# EAGLE design DyIO_Rev13_testjig (EAGLE 5.11)

## Sheet 1 of 6
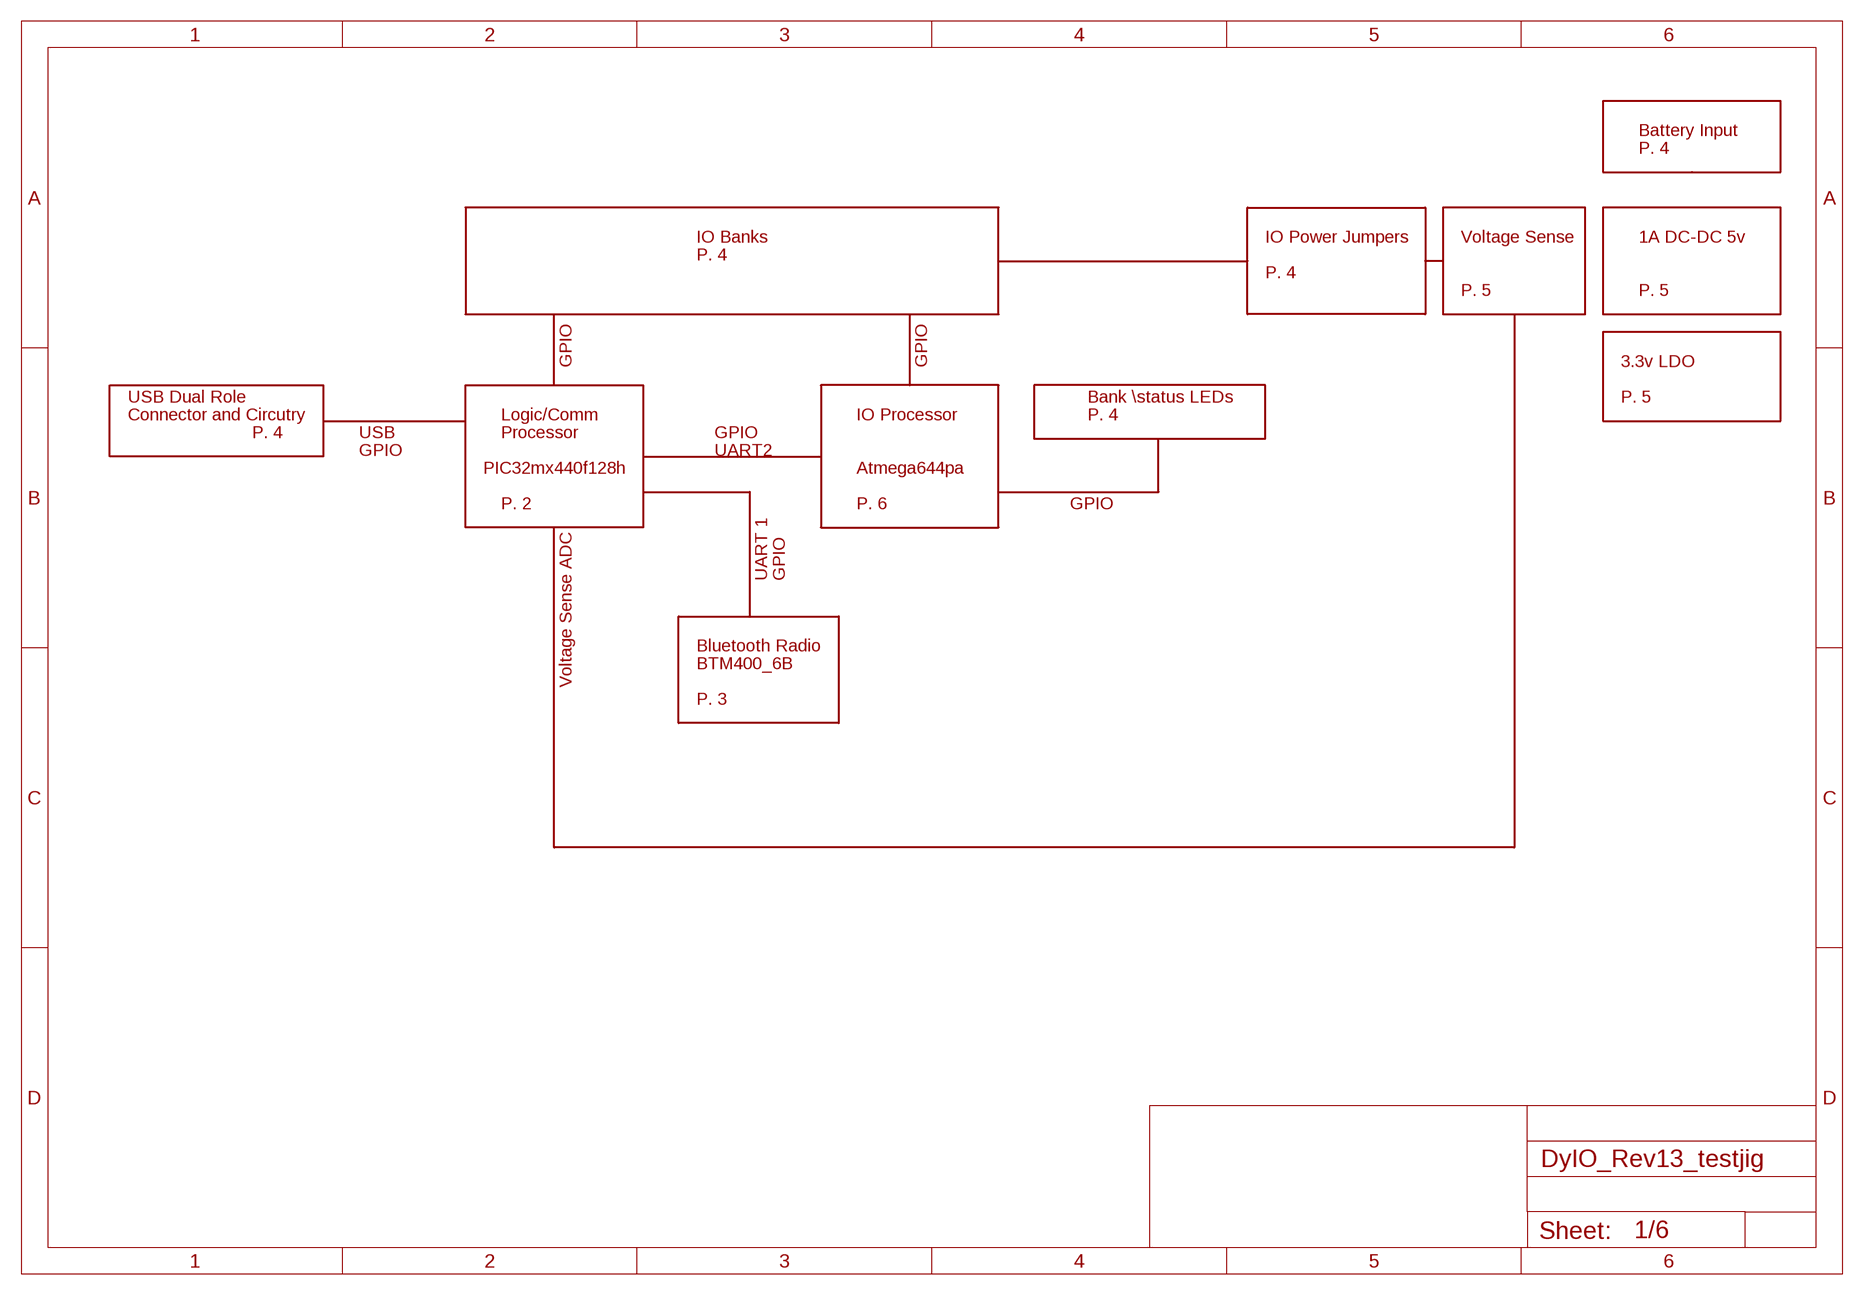
[diagram p0: schematic, sheet 1]

### Notes on the sheet
- Battery Input
- P. 4
- IO Banks | IO Power Jumpers | Voltage Sense | 1A DC-DC 5v
- P. 4
- P. 4
- P. 5 | P. 5
- GPIO | GPIO | 3.3v LDO
- USB Dual Role | Bank \status LEDs | P. 5
- Connector and Circutry | Logic/Comm | IO Processor | P. 4
- P. 4 | USB | Processor | GPIO
- GPIO | UART2
- PIC32mx440f128h | Atmega644pa
- P. 2 | P. 6 | GPIO
- UART 1 | GPIO
- Bluetooth Radio
- BTM400_6B
- Voltage Sense ADC
- P. 3

## Sheet 2 of 6
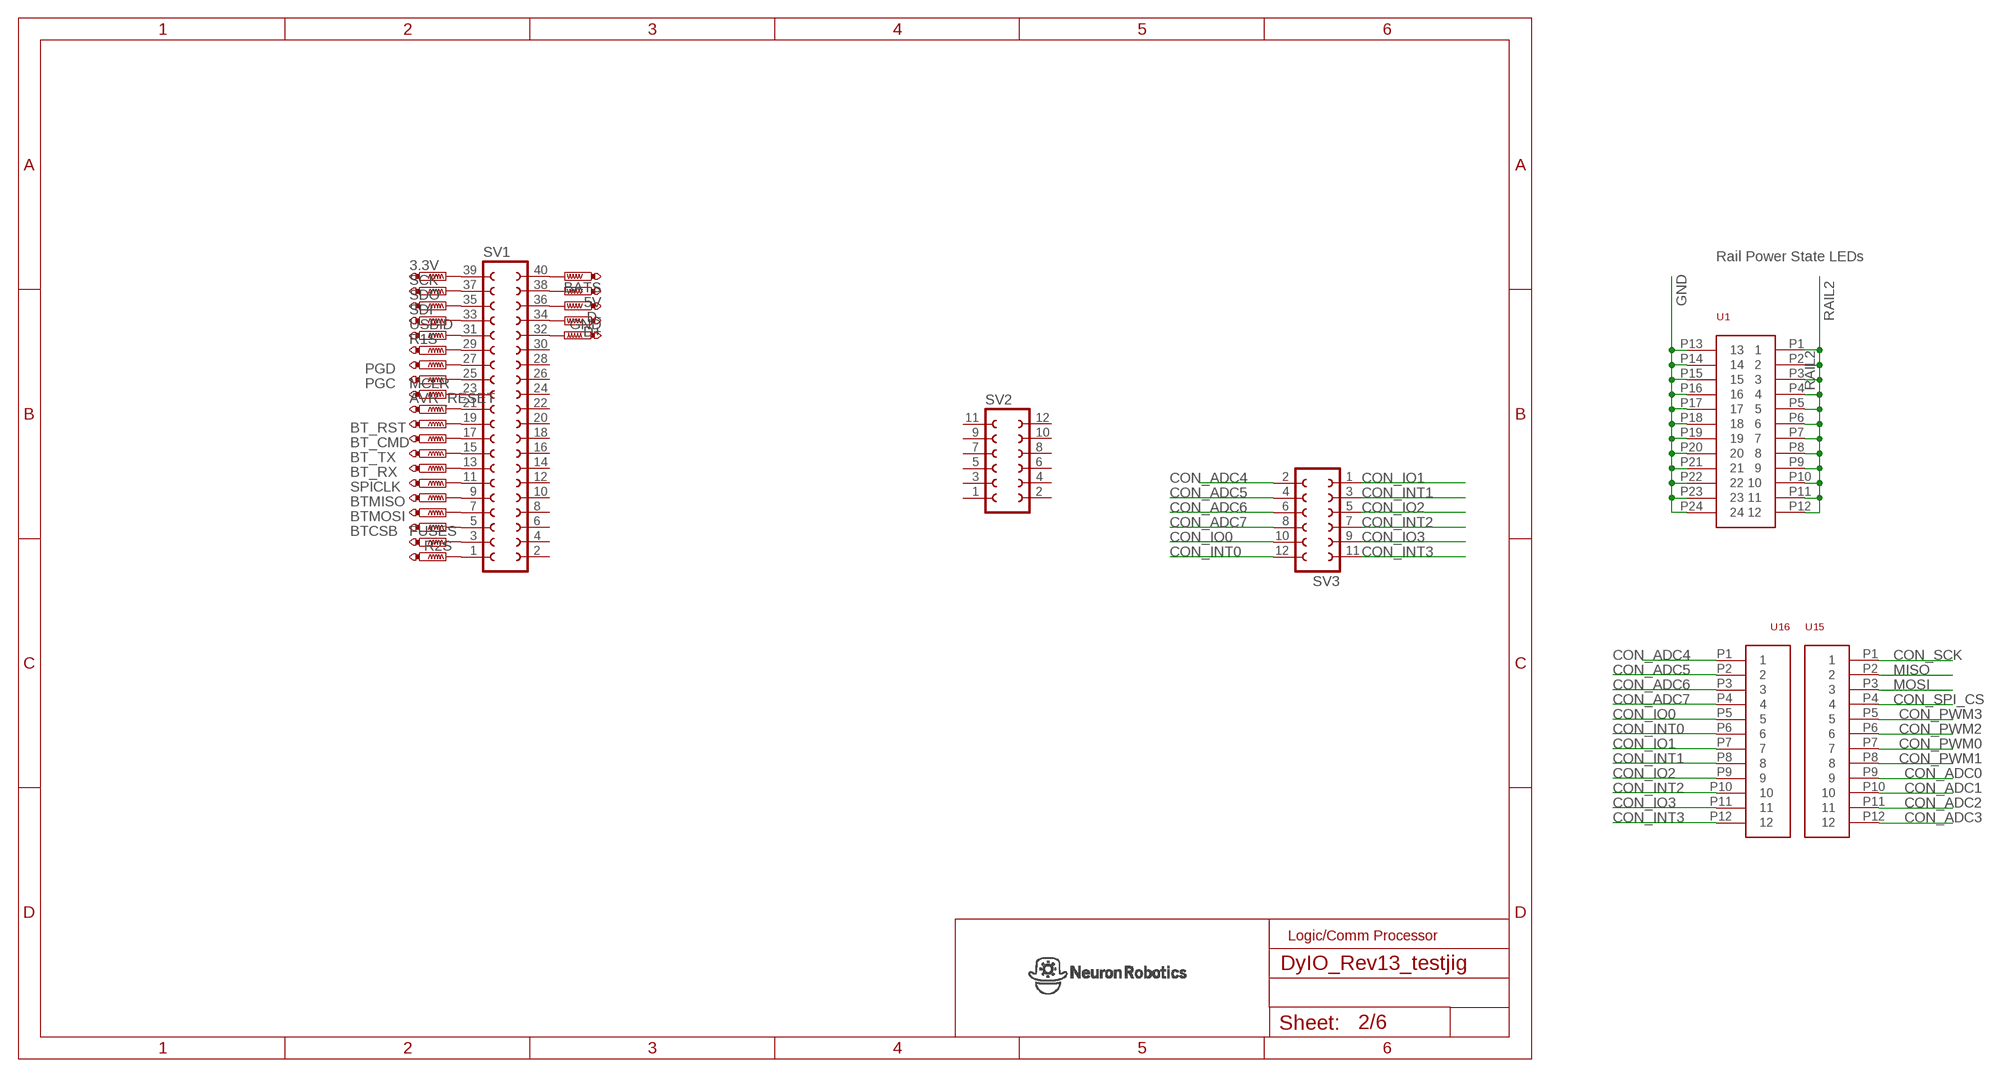
[diagram p1: schematic, sheet 2, part 1 of 2]
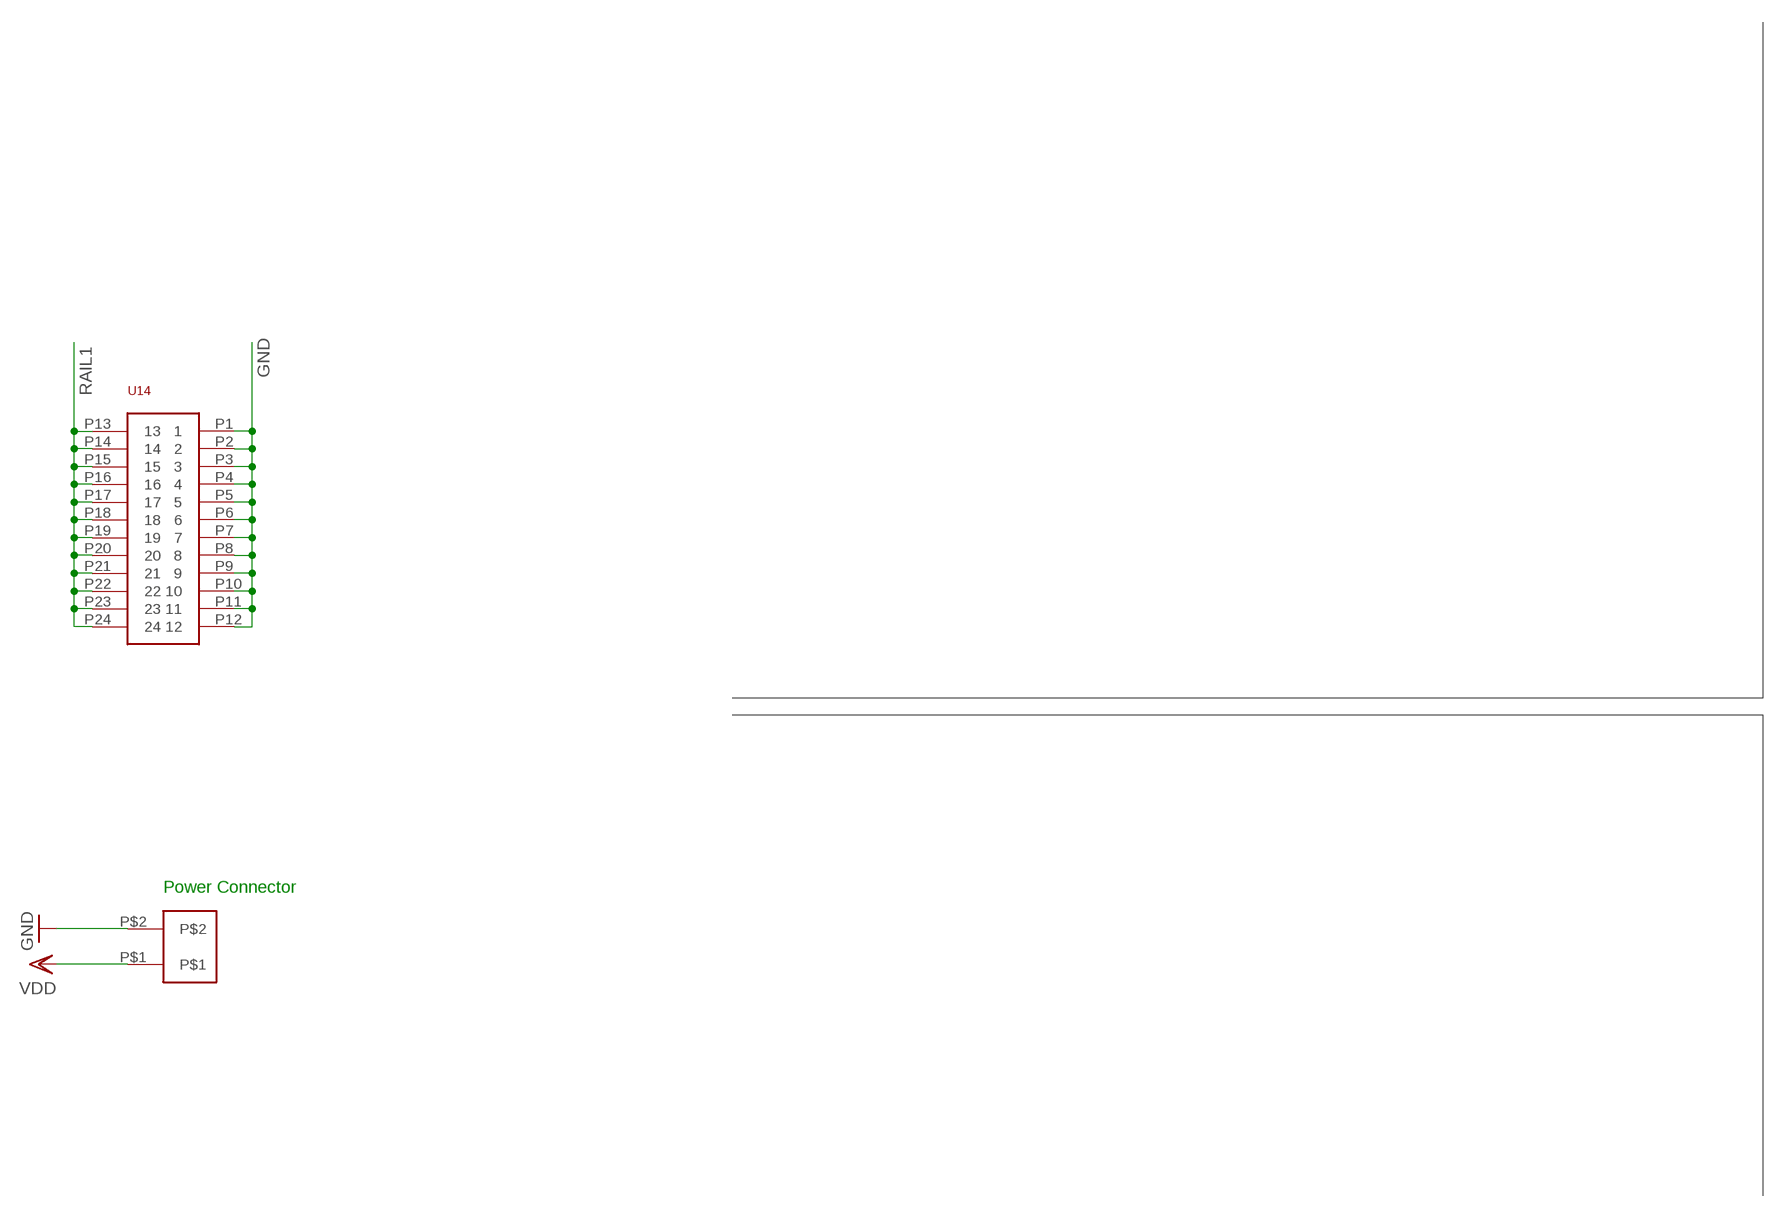
[diagram p2: schematic, sheet 2, part 2 of 2]

### Parts
3.3V  PTR1TP14R  [TP14R]
5V  PTR1TP14R  [TP14R]
AVR_RESET  PTR1TP14R  [TP14R]
BATS  PTR1TP14R  [TP14R]
BT_CMD  PTR1TP14R  [TP14R]
BT_RST  PTR1TP14R  [TP14R]
BT_RX  PTR1TP14R  [TP14R]
BT_TX  PTR1TP14R  [TP14R]
BTCSB  PTR1TP14R  [TP14R]
BTMISO  PTR1TP14R  [TP14R]
BTMOSI  PTR1TP14R  [TP14R]
D+  PTR1TP14R  [TP14R]
D-  PTR1TP14R  [TP14R]
FUSES  PTR1TP14R  [TP14R]
GND  PTR1B1,27  [B1,27]
MCLR  PTR1TP14R  [TP14R]
PGC  PTR1TP14R  [TP14R]
PGD  PTR1TP14R  [TP14R]
R1S  PTR1TP14R  [TP14R]
R2S  PTR1TP14R  [TP14R]
SCK  PTR1TP14R  [TP14R]
SDI  PTR1TP14R  [TP14R]
SDO  PTR1TP14R  [TP14R]
SPICLK  PTR1TP14R  [TP14R]
SV1  FE20-2  [FE20-2]
SV2  FE06-2  [FE06-2]
SV3  FE06-2  [FE06-2]
U1  2X12  [2X12]
U14  2X12  [2X12]
U15  1X12  [1X12]
U16  1X12  [1X12]
U$19  2P  [2PTH]
USBID  PTR1TP14R  [TP14R]

### Nets
CON_ADC0: U15.P9
CON_ADC1: U15.P10
CON_ADC2: U15.P11
CON_ADC3: U15.P12
CON_ADC4: SV3.2 U16.P1
CON_ADC5: SV3.4 U16.P2
CON_ADC6: SV3.6 U16.P3
CON_ADC7: SV3.8 U16.P4
CON_INT0: SV3.12 U16.P6
CON_INT1: SV3.3 U16.P8
CON_INT2: SV3.7 U16.P10
CON_INT3: SV3.11 U16.P12
CON_IO0: SV3.10 U16.P5
CON_IO1: SV3.1 U16.P7
CON_IO2: SV3.5 U16.P9
CON_IO3: SV3.9 U16.P11
CON_PWM0: U15.P7
CON_PWM1: U15.P8
CON_PWM2: U15.P6
CON_PWM3: U15.P5
CON_SCK: U15.P1
CON_SPI_CS: U15.P4
GND: U1.P13 U1.P14 U1.P15 U1.P16 U1.P17 U1.P18 U1.P19 U1.P20 U1.P21 U1.P22 U1.P23 U1.P24 U14.P1 U14.P2 U14.P3 U14.P4 U14.P5 U14.P6 U14.P7 U14.P8 U14.P9 U14.P10 U14.P11 U14.P12 U$19.P$2
MISO: U15.P2
MOSI: U15.P3
N$30: R2S.TP SV1.1
N$31: FUSES.TP SV1.3
N$32: BTCSB.TP SV1.5
N$33: BTMOSI.TP SV1.7
N$34: BTMISO.TP SV1.9
N$35: SPICLK.TP SV1.11
N$36: BT_RX.TP SV1.13
N$37: BT_TX.TP SV1.15
N$38: BT_CMD.TP SV1.17
N$39: BT_RST.TP SV1.19
N$40: MCLR.TP SV1.23
N$41: AVR_RESET.TP SV1.21
N$42: PGC.TP SV1.25
N$43: PGD.TP SV1.27
N$44: R1S.TP SV1.29
N$45: SV1.31 USBID.TP
N$46: SDI.TP SV1.33
N$47: SDO.TP SV1.35
N$48: SCK.TP SV1.37
N$49: 3.3V.TP SV1.39
N$50: BATS.TP SV1.40
N$51: 5V.TP SV1.38
N$52: D-.TP SV1.36
N$53: D+.TP SV1.34
N$54: GND.PP(TP) SV1.32
RAIL1: U14.P13 U14.P14 U14.P15 U14.P16 U14.P17 U14.P18 U14.P19 U14.P20 U14.P21 U14.P22 U14.P23 U14.P24
RAIL2: U1.P1 U1.P2 U1.P3 U1.P4 U1.P5 U1.P6 U1.P7 U1.P8 U1.P9 U1.P10 U1.P11 U1.P12
VDD: U$19.P$1
Unconnected: SV1.2 SV1.4 SV1.6 SV1.8 SV1.10 SV1.12 SV1.14 SV1.16 SV1.18 SV1.20 SV1.22 SV1.24 SV1.26 SV1.28 SV1.30 SV2.1 SV2.2 SV2.3 SV2.4 SV2.5 SV2.6 SV2.7 SV2.8 SV2.9 SV2.10 SV2.11 SV2.12

### Notes on the sheet
- Rail Power State LEDs
- Power Connector
- Logic/Comm Processor

## Sheet 3 of 6
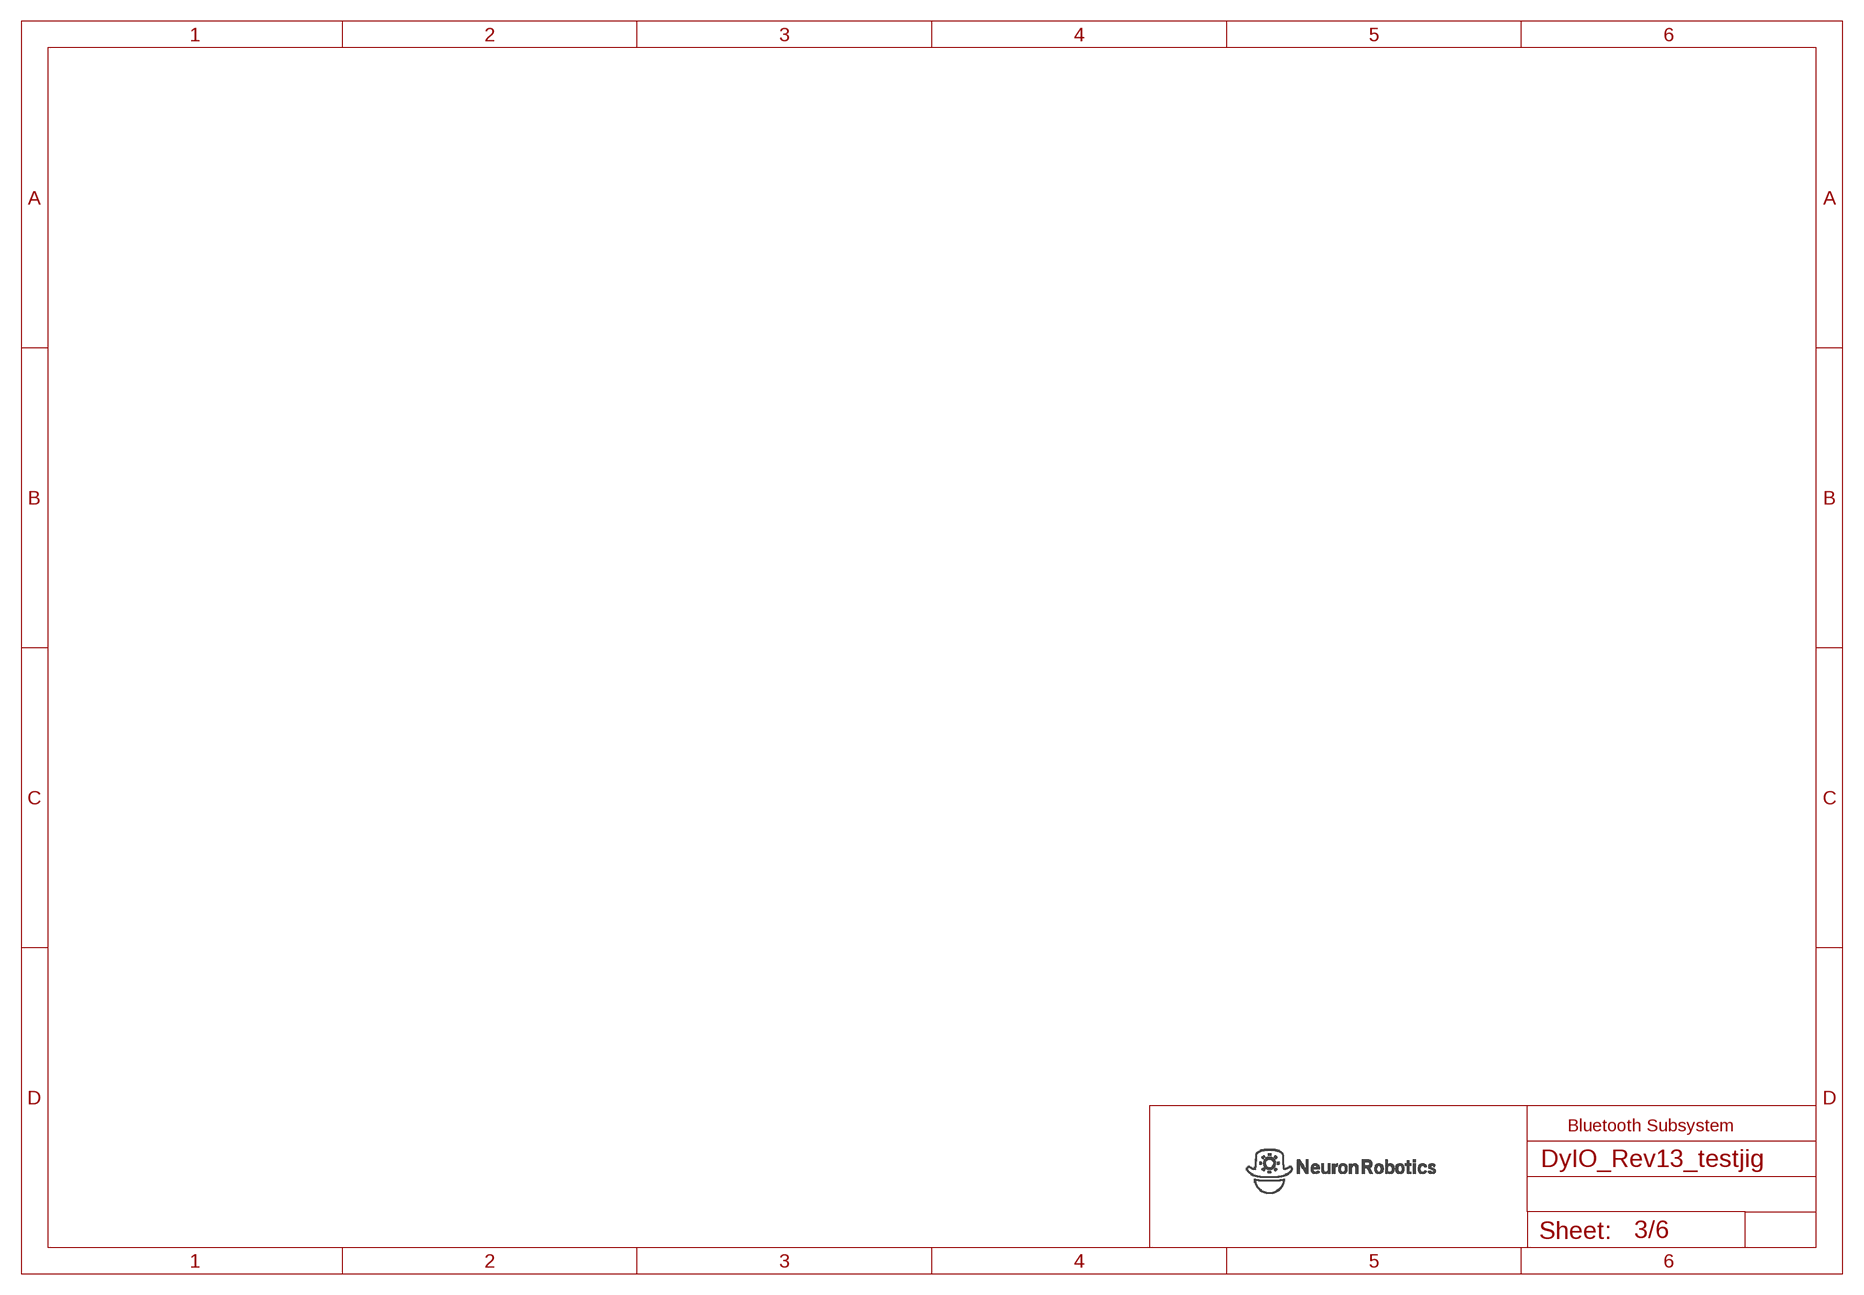
[diagram p3: schematic, sheet 3]

### Notes on the sheet
- Bluetooth Subsystem

## Sheet 4 of 6
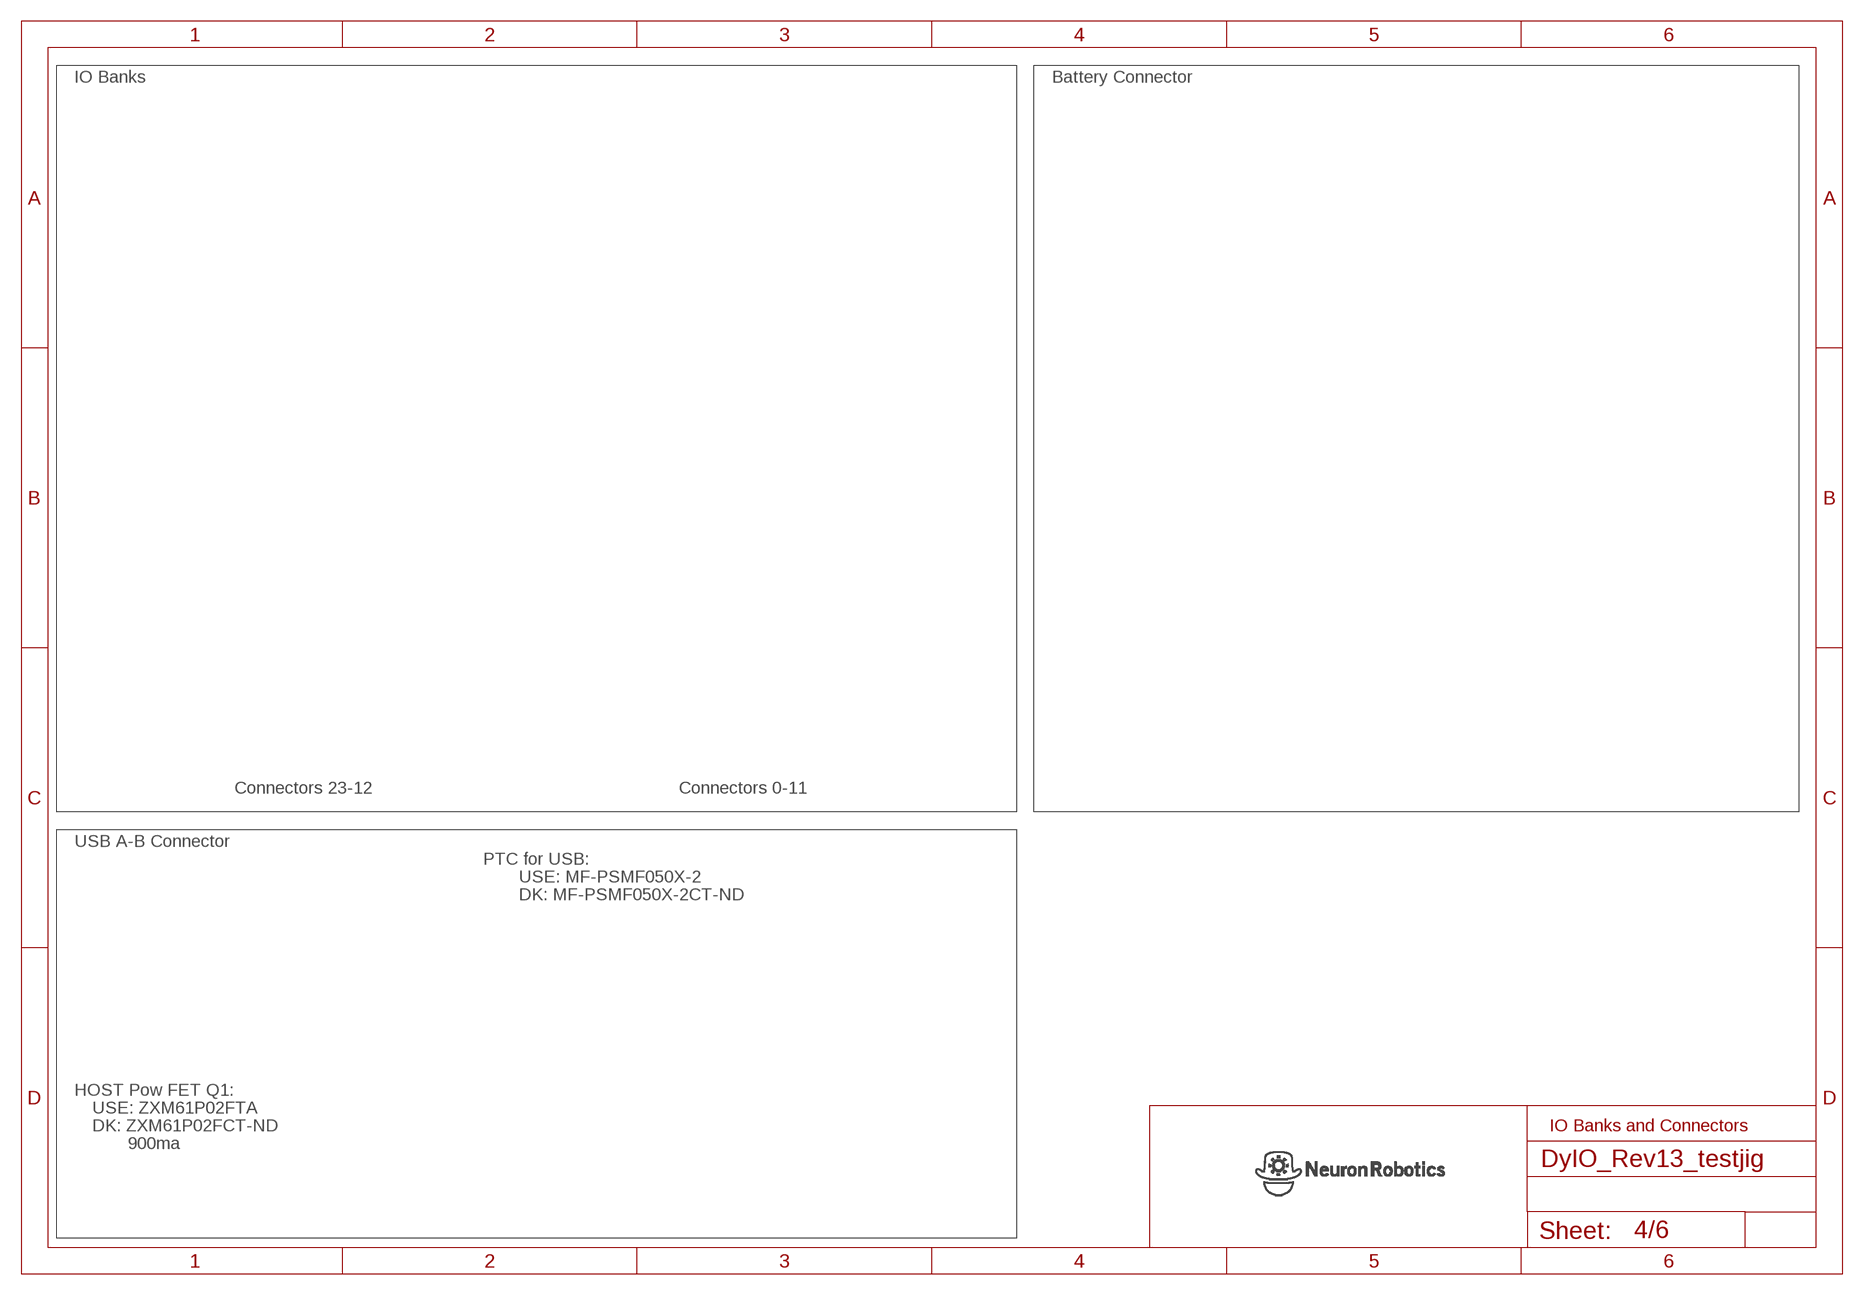
[diagram p4: schematic, sheet 4]

### Notes on the sheet
- IO Banks | Battery Connector
- Connectors 23-12 | Connectors 0-11
- USB A-B Connector
- PTC for USB:
- USE: MF-PSMF050X-2
- DK: MF-PSMF050X-2CT-ND
- HOST Pow FET Q1:
- USE: ZXM61P02FTA
- DK: ZXM61P02FCT-ND | IO Banks and Connectors
- 900ma

## Sheet 5 of 6
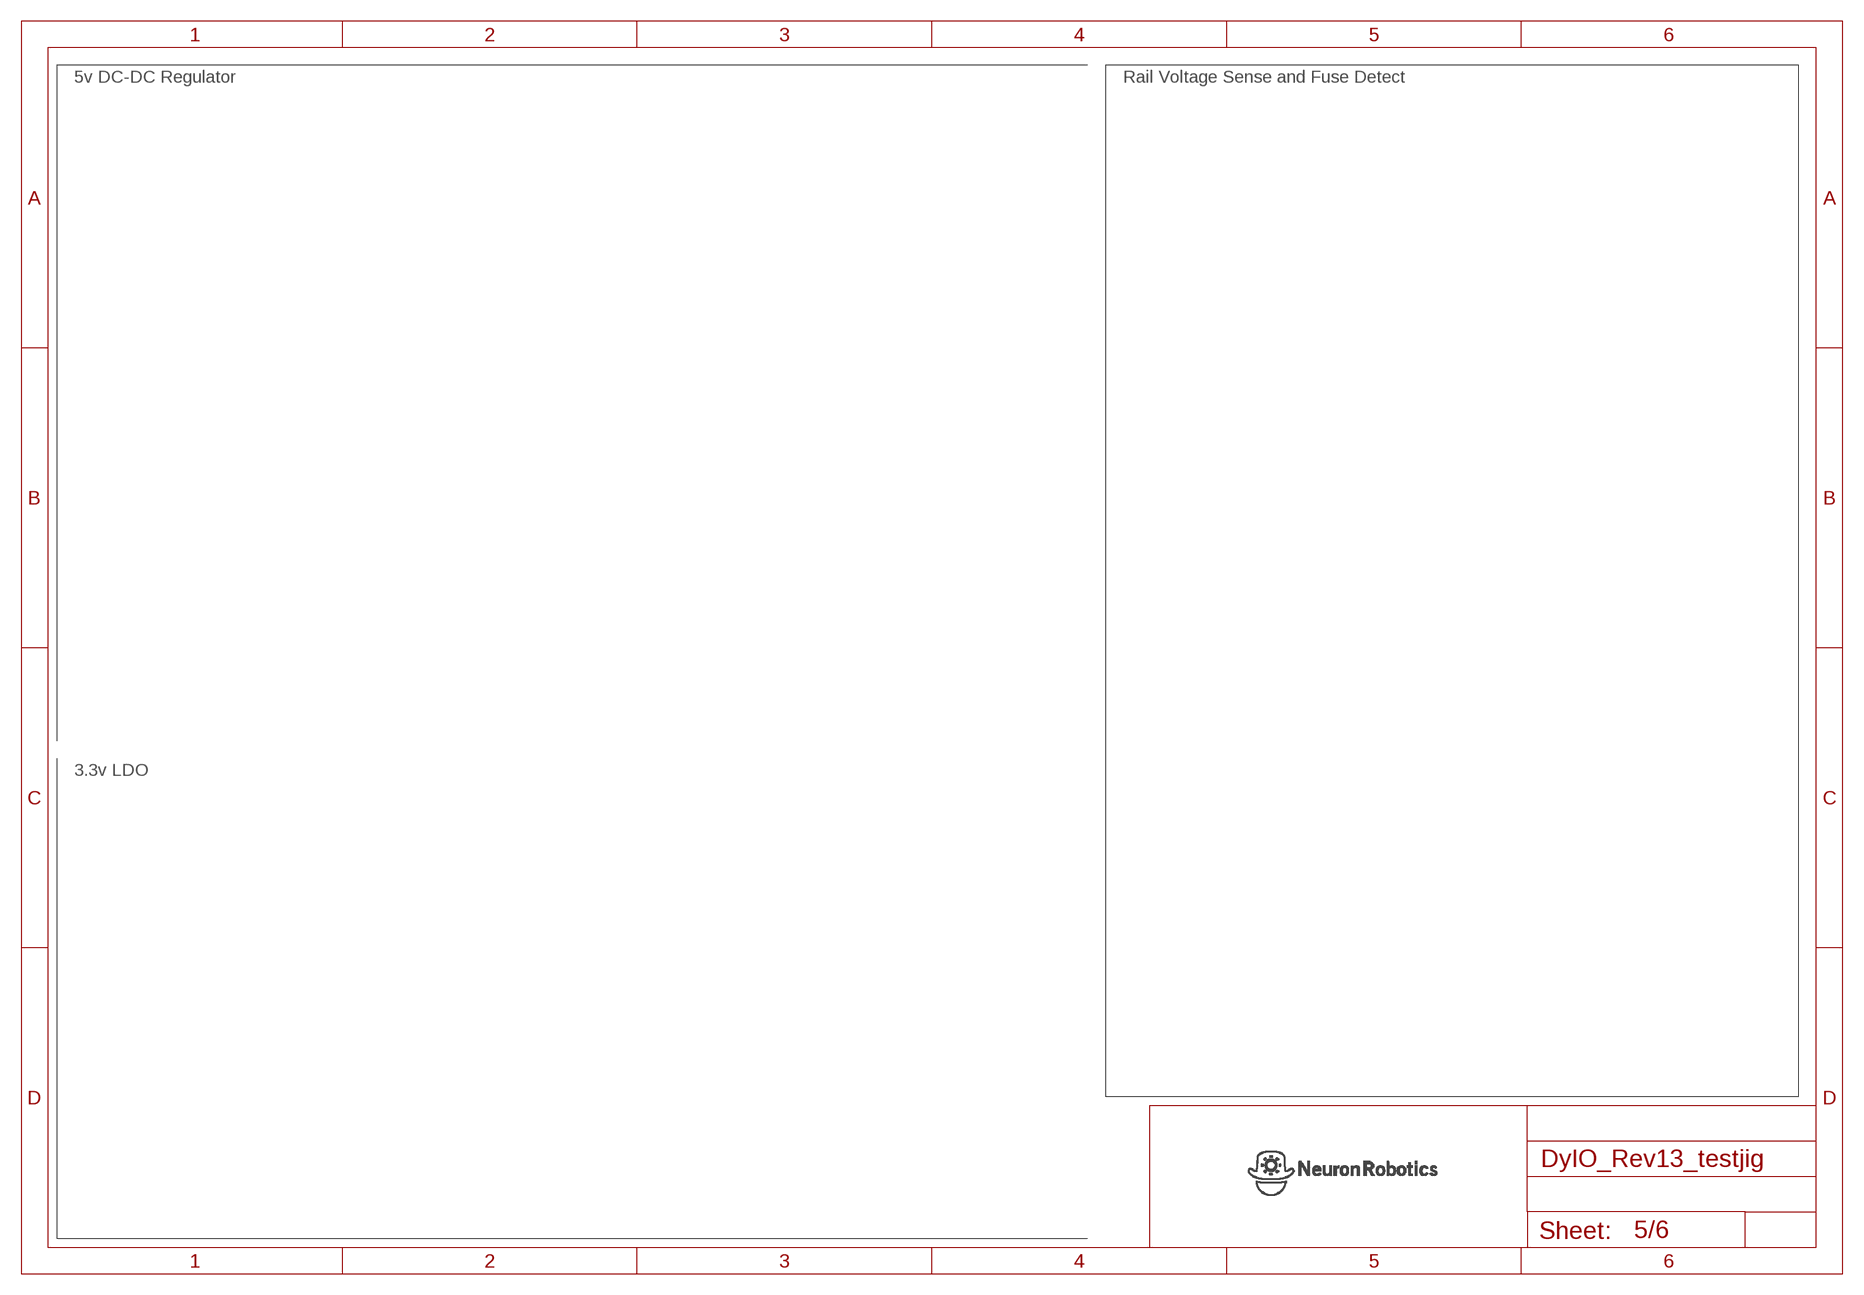
[diagram p5: schematic, sheet 5]

### Notes on the sheet
- 5v DC-DC Regulator | Rail Voltage Sense and Fuse Detect
- 3.3v LDO

## Sheet 6 of 6
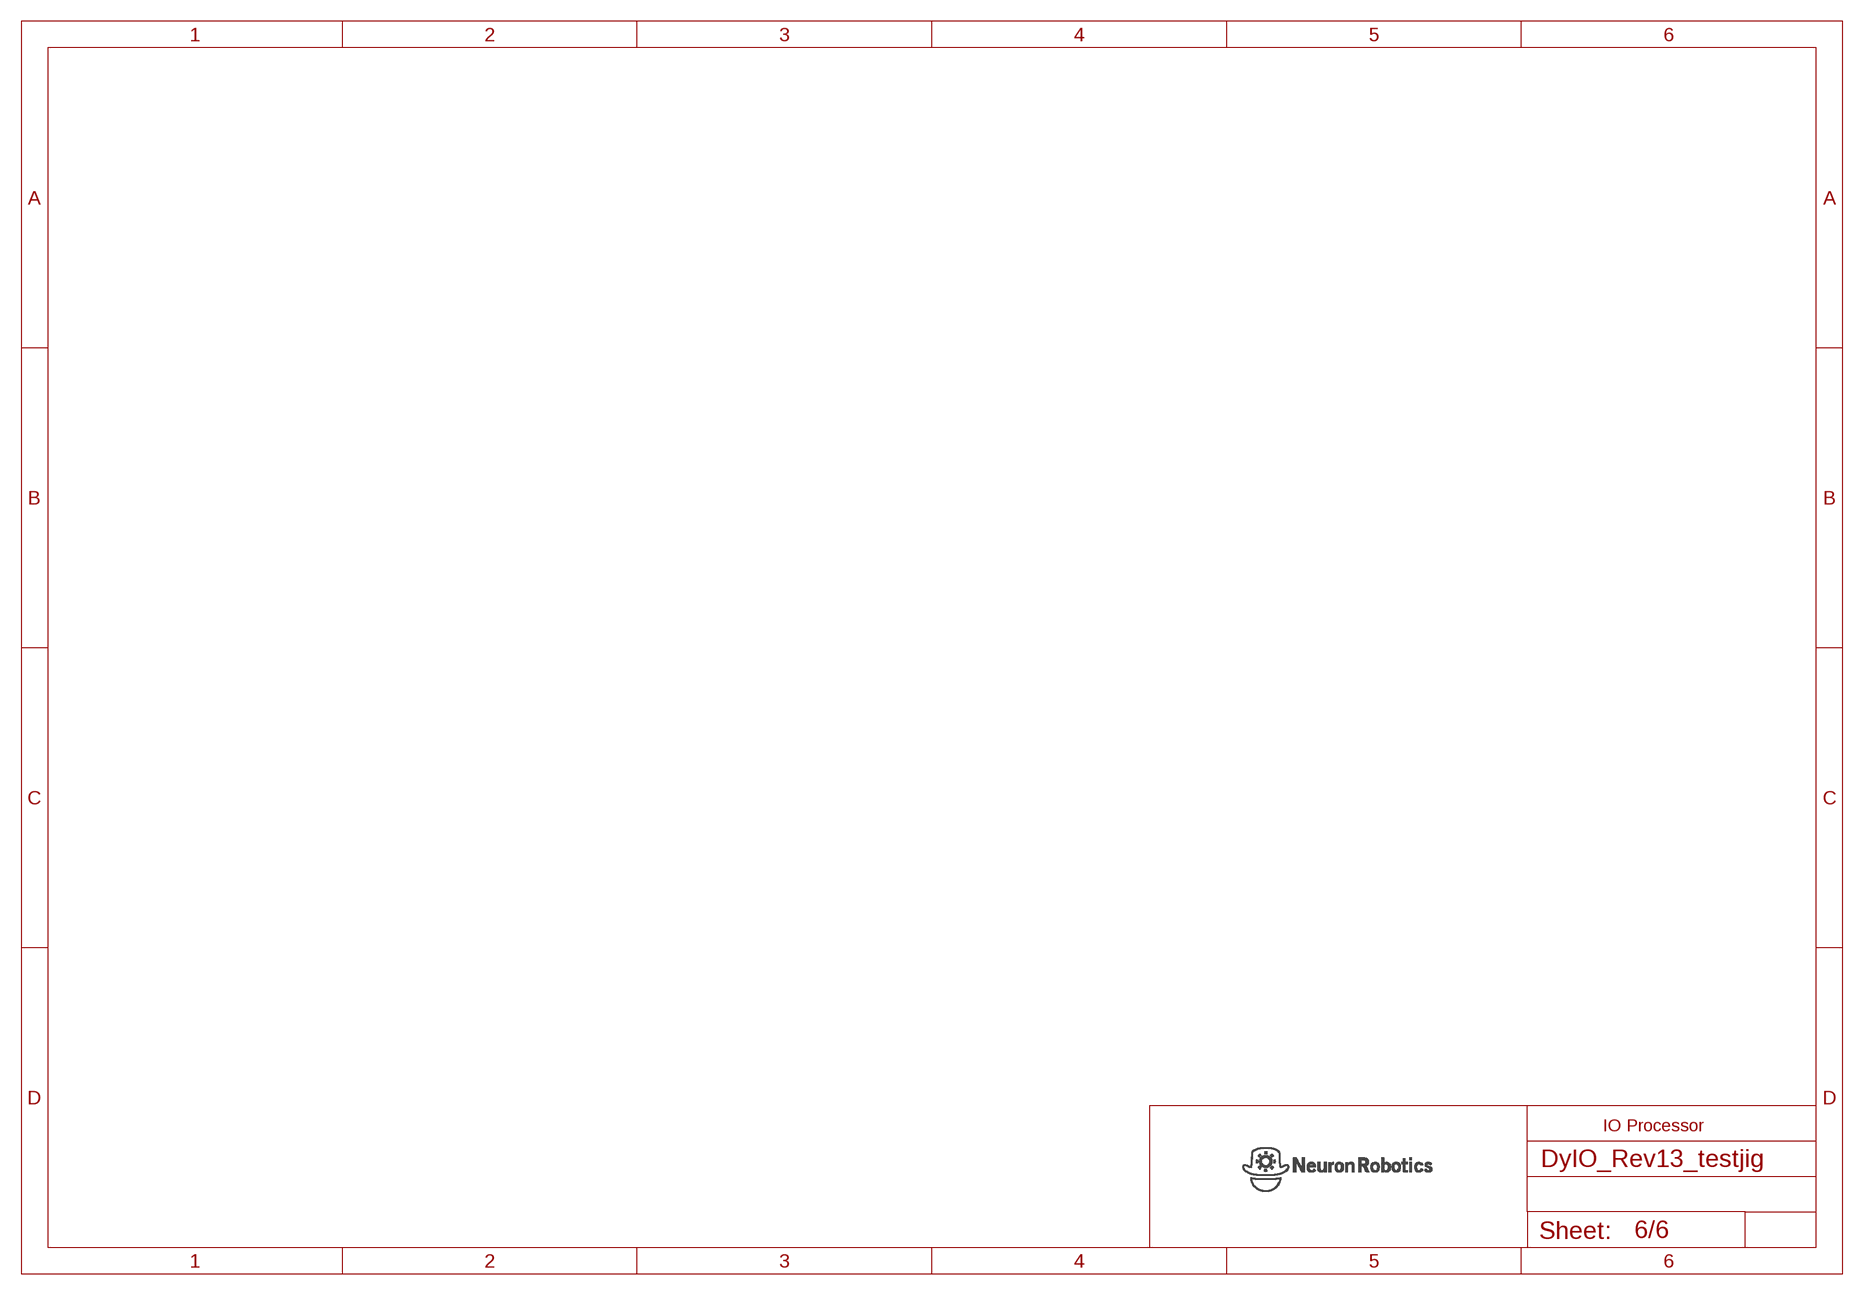
[diagram p6: schematic, sheet 6]

### Notes on the sheet
- IO Processor

## Library data of the parts
3.3V 5V AVR_RESET BATS BT_CMD BT_RST BT_RX BT_TX BTCSB BTMISO BTMOSI D+ D- FUSES GND MCLR PGC PGD R1S R2S SCK SDI SDO SPICLK USBID = testpad:PTR1: TEST PIN
SV1 = con-lsta:FE20-2: FEMALE HEADER; OC_FARNELL: unknown; OC_NEWARK: unknown
SV2 SV3 = con-lsta:FE06-2: FEMALE HEADER; OC_FARNELL: unknown; OC_NEWARK: unknown
U1 U14 = 1x12_header:2X12
U15 U16 = 1x12_header:1X12
U$19 = con_2h_70555-0001:2P

## Board
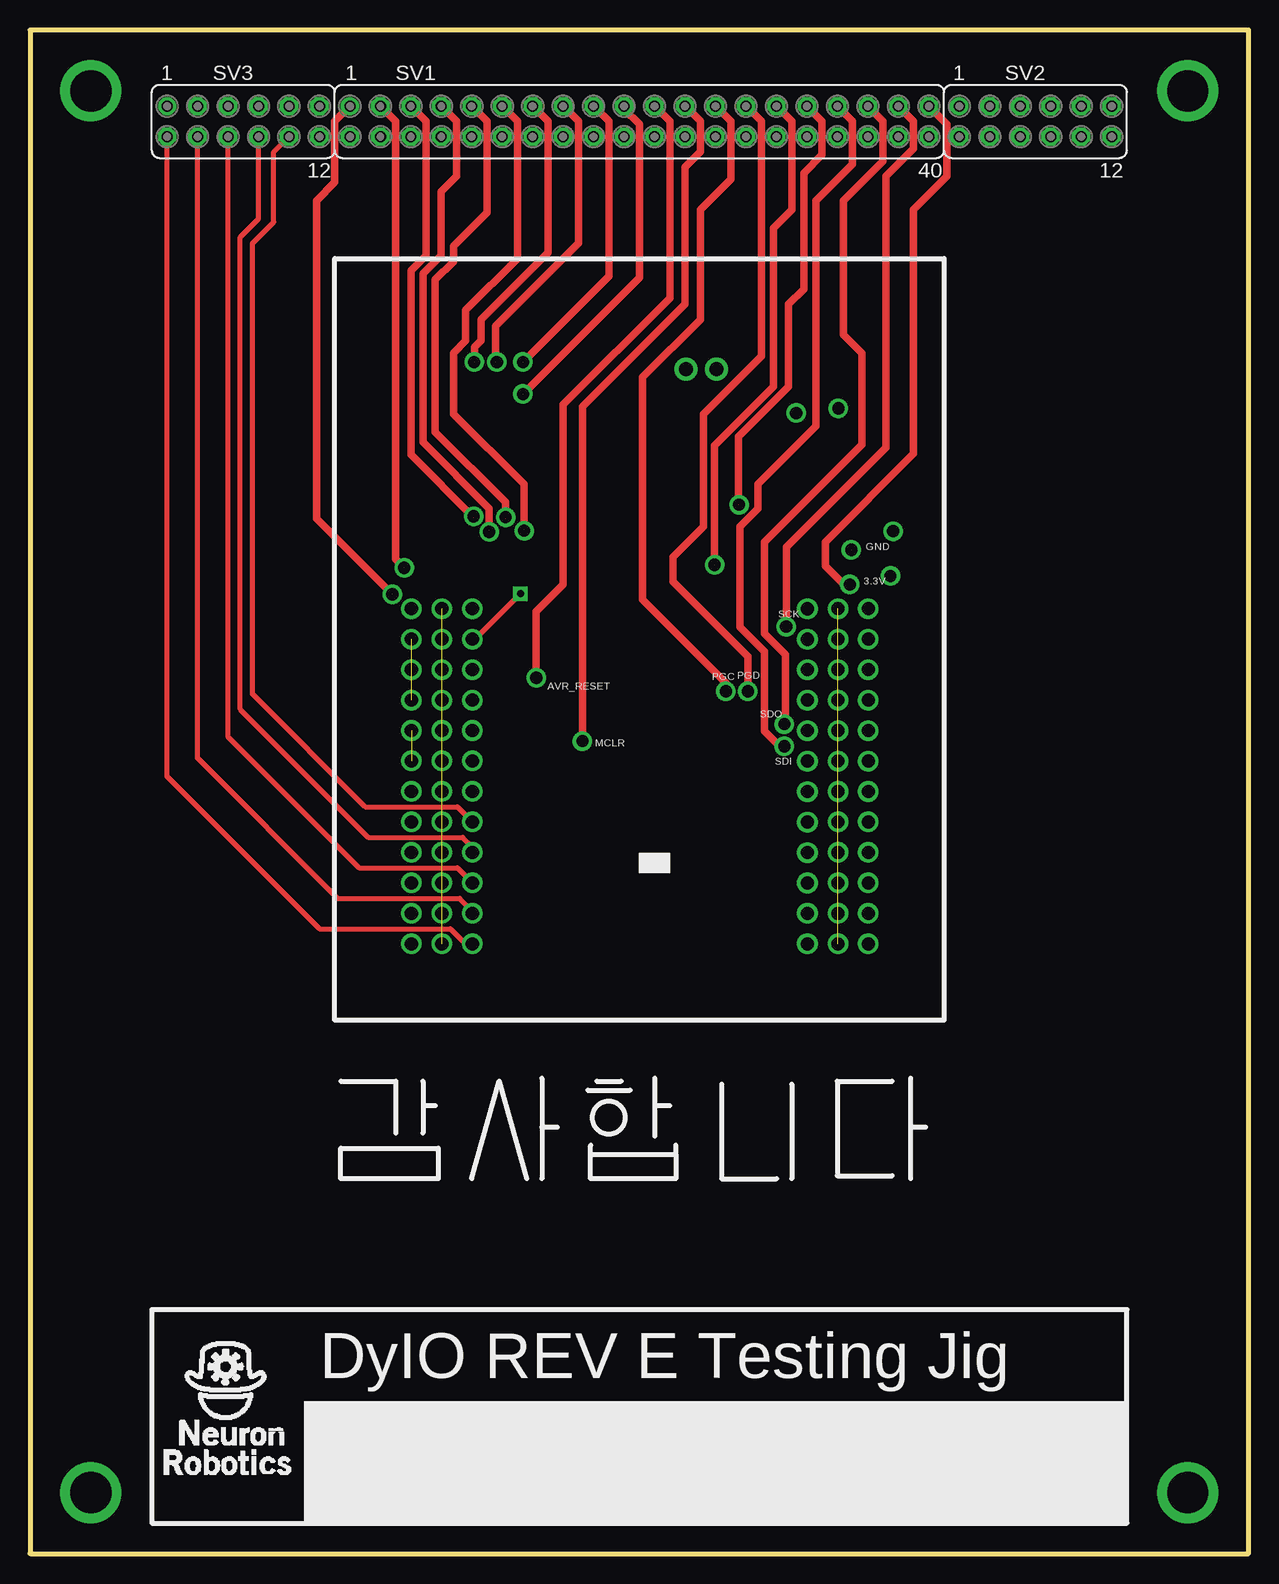
[diagram p7: board, top side]
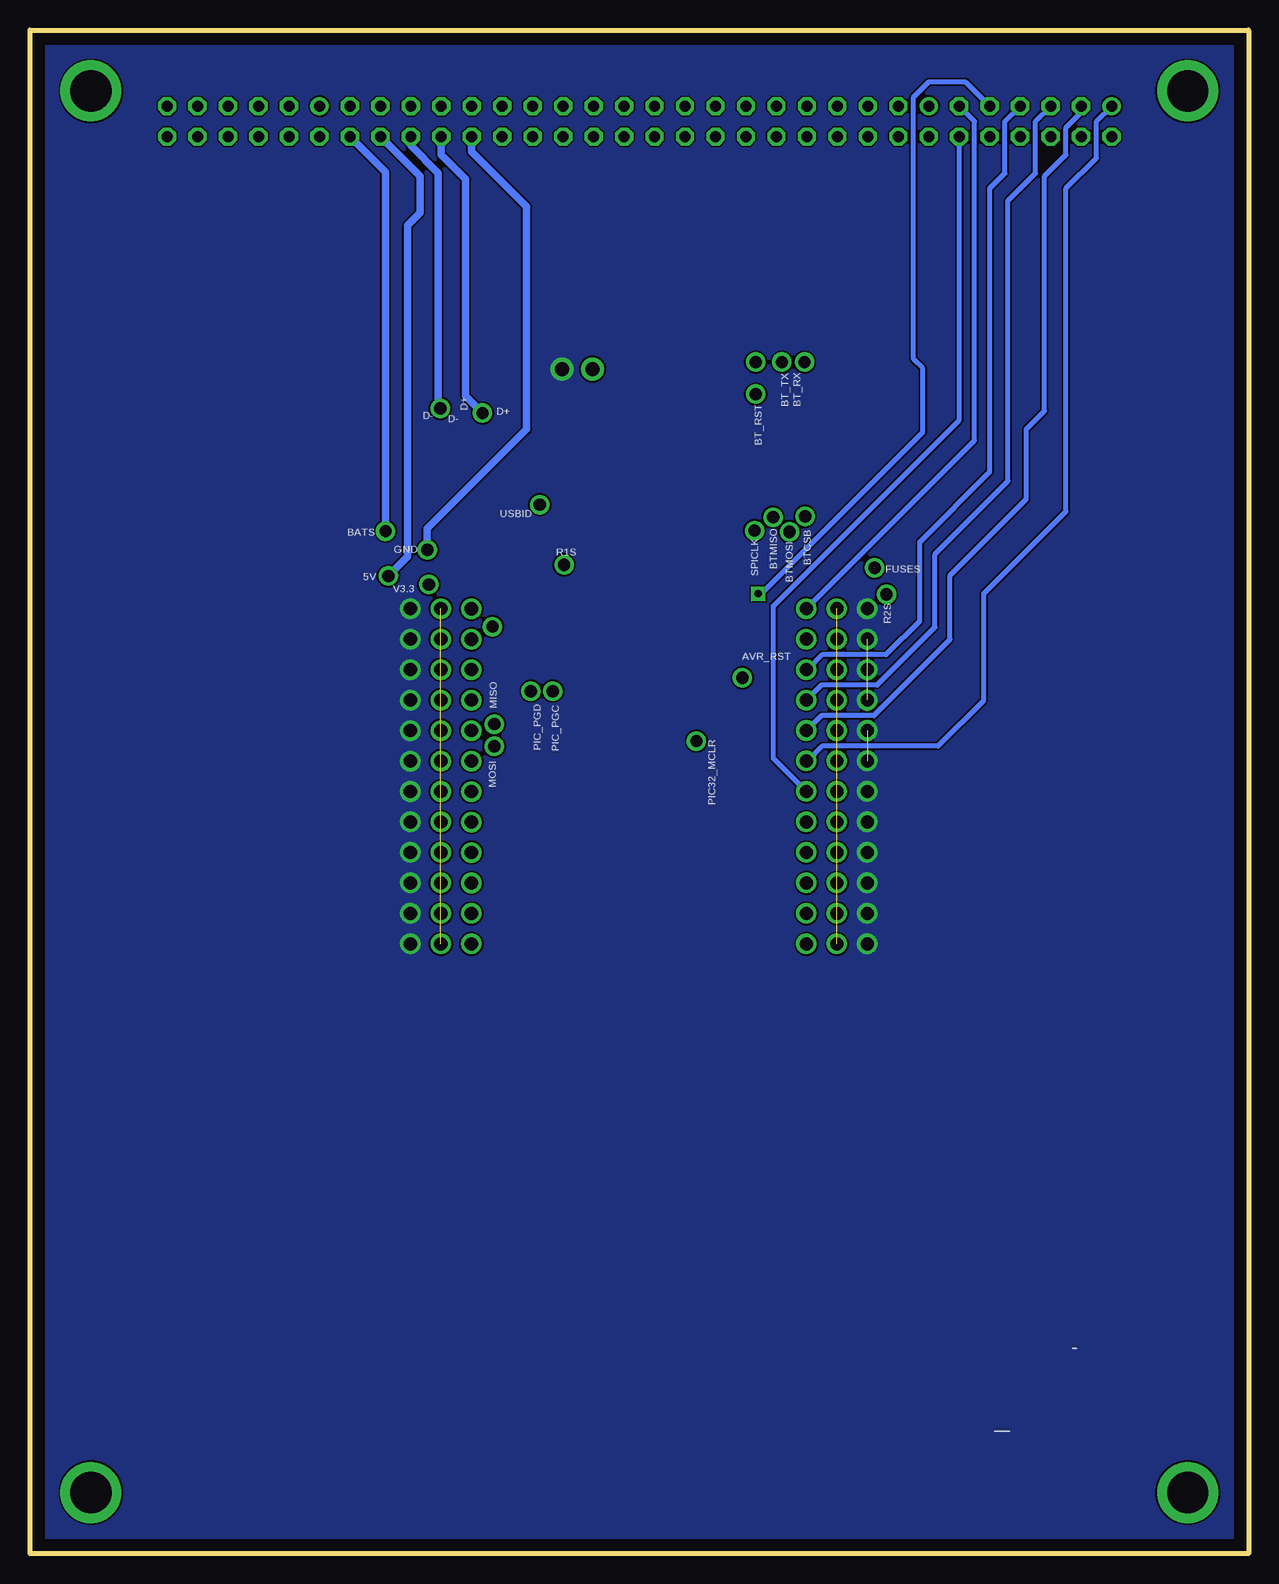
[diagram p8: board, bottom side, seen from below]

Size 101.6 x 127 mm. Coordinates in mm from the lower left corner, seen from the top.
Outline: 0,0 101.6,0 101.6,127 0,127 0,0
Copper layers (1*16): Top 0.035mm / dielectric 1.5mm / Bottom 0.035mm
Design rules "default *": minimum track width 6mil, minimum drill 15mil, track to track 6mil, track to pad 6mil, pad to pad 6mil, via to via 6mil, smd to smd 6mil, copper to edge 40mil, drill to drill 6mil, minimum pad ring 12mil, minimum via ring 12mil, stop-mask expansion 4mil, vias tented up to drill 20mil, thermal gap 0mil

### Footprints (pad centres in the part's own frame; a part is rotated, then mirrored left to right if it is on the bottom)
TP14R = smd 1.4 x 1.4: TP 0,0
B1,27 = smd 1.27 x 1.27: PP 0,0
FE20-2 = drill 0.914 round: 1 -24.13,1.27 | drill 0.914 octagon: 2 -24.13,-1.27; 3 -21.59,1.27; 4 -21.59,-1.27; 5 -19.05,1.27; 6 -19.05,-1.27; 7 -16.51,1.27; 8 -16.51,-1.27; 9 -13.97,1.27; 10 -13.97,-1.27; 11 -11.43,1.27; 12 -11.43,-1.27; 13 -8.89,1.27; 14 -8.89,-1.27; 15 -6.35,1.27; 16 -6.35,-1.27; 17 -3.81,1.27; 18 -3.81,-1.27; 19 -1.27,1.27; 20 -1.27,-1.27; 21 1.27,1.27; 22 1.27,-1.27; 23 3.81,1.27; 24 3.81,-1.27; 25 6.35,1.27; 26 6.35,-1.27; 27 8.89,1.27; 28 8.89,-1.27; 29 11.43,1.27; 30 11.43,-1.27; 31 13.97,1.27; 32 13.97,-1.27; 33 16.51,1.27; 34 16.51,-1.27; 35 19.05,1.27; 36 19.05,-1.27; 37 21.59,1.27; 38 21.59,-1.27; 39 24.13,1.27; 40 24.13,-1.27
FE06-2 = drill 0.914 round: 1 -6.35,1.27 | drill 0.914 octagon: 2 -6.35,-1.27; 3 -3.81,1.27; 4 -3.81,-1.27; 5 -1.27,1.27; 6 -1.27,-1.27; 7 1.27,1.27; 8 1.27,-1.27; 9 3.81,1.27; 10 3.81,-1.27; 11 6.35,1.27; 12 6.35,-1.27
2X12 = drill 1.1 round: P1 -0.635,0.635; P2 1.905,0.635; P3 4.445,0.635; P4 6.985,0.635; P5 9.525,0.635; P6 12.065,0.635; P7 14.605,0.635; P8 17.145,0.635; P9 19.685,0.635; P10 22.225,0.635; P11 24.765,0.635; P12 27.305,0.635; P13 -0.635,-1.905; P14 1.905,-1.905; P15 4.445,-1.905; P16 6.985,-1.905; P17 9.525,-1.905; P18 12.065,-1.905; P19 14.605,-1.905; P20 17.145,-1.905; P21 19.685,-1.905; P22 22.225,-1.905; P23 24.765,-1.905; P24 27.305,-1.905
1X12 = drill 1.1 round: P1 -10.795,3.175; P2 -8.255,3.175; P3 -5.715,3.175; P4 -3.175,3.175; P5 -0.635,3.175; P6 1.905,3.175; P7 4.445,3.175; P8 6.985,3.175; P9 9.525,3.175; P10 12.065,3.175; P11 14.605,3.175; P12 17.145,3.175
2PTH = drill 1.168 pad 1.93 round: P$1 -2.54,0; P$2 0,0

### Placement (x,y rotation side)
3.3V  68.35,80.75 0 top
5V  71.73,81.48 90 bottom
AVR_RESET  42.2,73 0 top
BATS  71.96,85.22 0 bottom
BT_CMD  41.1,99.31 0 bottom
BT_RST  41.1,96.65 0 bottom
BT_RX  37.06,99.31 0 bottom
BT_TX  38.81,99.31 0 bottom
BTCSB  36.98,86.36 0 bottom
BTMISO  39.65,86.28 0 bottom
BTMOSI  38.28,85.29 0 bottom
D+  63.88,95.07 90 bottom
D-  67.37,95.45 0 bottom
FUSES  31.19,82.17 0 bottom
GND  68.49,83.66 0 top
MCLR  46.06,67.7 0 top
PGC  58,71.85 90 top
PGD  59.85,71.85 90 top
R1S  57.06,82.41 0 bottom
R2S  30.2,79.96 0 bottom
SCK  63.05,77.25 0 top
SDI  62.9,67.3 0 top
SDO  62.9,69.15 0 top
SPICLK  41.17,85.37 0 bottom
SV1  50.8,119.38 0 top
SV2  83.82,119.38 0 top
SV3  17.78,119.38 0 top
U1  33.7,78.13 270 top
U14  69.26,78.13 270 top
U15  67.99,67.96 270 bottom
U16  40.06,61.62 90 top
U$19  57.23,98.73 0 top
USBID  59.08,87.43 0 bottom

### Tracks (layer width: path | path; a pad name or v marks a point on that pad's centre or on a via)
CON_ADC4
  Top 0.406: SV3.2 11.43,64.77 24.13,52.07 35.05,52.07 36.3,50.82 U16.P1
CON_ADC5
  Top 0.406: SV3.4 13.97,66.29 25.65,54.61 35.81,54.61 36.88,53.54 U16.P2
CON_ADC6
  Top 0.406: SV3.6 16.51,68.07 27.43,57.15 35.64,57.15 U16.P3
CON_ADC7
  Top 0.406: SV3.8 19.05,111.25 17.53,109.73 17.53,70.36 28.19,59.69 36.07,59.69 36.88,58.88 U16.P4
CON_INT0
  Bottom 0.406: U16.P6 39.62,66.27 39.62,78.99 24.13,94.49 SV3.12
CON_INT1
  Bottom 0.406: U16.P8 35.64,69.85 31.24,69.85 24.89,76.2 24.89,81.53 18.54,87.88 18.54,93.73 17.02,95.25 17.02,114.81 15.24,116.59 15.24,118.87 13.97,120.14 SV3.3
CON_INT2
  Bottom 0.406: U16.P10 36.81,73.68 35.56,74.93 30.23,74.93 27.43,77.72 27.43,84.33 21.59,90.17 21.59,113.79 20.32,115.06 20.32,119.38 SV3.7
CON_INT3
  Bottom 0.406: U16.P12 22.86,92.78 22.86,119.38 SV3.11
CON_IO0
  Top 0.406: SV3.10 20.32,116.84 20.32,111 18.54,109.22 18.54,71.63 27.94,62.23 35.64,62.23 U16.P5
CON_IO1
  Bottom 0.406: U16.P7 36.81,66.06 35.56,67.31 25.91,67.31 22.1,71.12 22.1,80.01 15.24,86.87 15.24,113.79 12.7,116.33 12.7,119.38 SV3.1
CON_IO2
  Bottom 0.406: U16.P9 35.64,72.39 30.99,72.39 26.16,77.22 26.16,83.31 20.07,89.41 20.07,112.78 17.78,115.06 17.78,119.38 SV3.5
CON_IO3  (via drill 0.6)
  Top 0.406: U16.P11 37.11,76.22 v40.89,80.01
  Bottom 0.406: v40.89,80.01 40.64,80.01 27.18,93.47 27.18,98.81 27.94,99.57 27.94,121.41 26.67,122.68 23.62,122.68 SV3.9
GND  (3 unrouted)
  pour Bottom: 0,127 101.6,127 101.6,25.4 101.6,0 0,0
N$1  (via drill 1.02)
  other vias: 41.2,85.27
N$2  (via drill 1.02)
  other vias: 39.65,86.39
N$3  (via drill 1.02)
  other vias: 38.28,85.17
N$4  (via drill 1.02)
  other vias: 36.98,86.46
N$5  (via drill 1.02)
  other vias: 37.03,99.31
N$6  (via drill 1.02)
  other vias: 38.91,99.31
N$7  (via drill 1.02)
  other vias: 41.1,99.31
N$8  (via drill 1.02)
  other vias: 41.1,96.65
N$9  (via drill 1.02)
  other vias: 67.39,95.45
N$10  (via drill 1.02)
  other vias: 63.88,95.07
N$11  (via drill 1.02)
  other vias: 71.96,85.22
N$12  (via drill 1.02)
  other vias: 71.73,81.48
N$13  (via drill 1.02)
  other vias: 68.48,83.67
N$14  (via drill 1.02)
  other vias: 68.35,80.77
N$15  (via drill 1.02)
  other vias: 63.04,77.27
N$16  (via drill 1.02)
  other vias: 59.84,71.88
N$17  (via drill 1.02)
  other vias: 58.01,71.88
N$18  (via drill 1.02)
  other vias: 62.89,69.14
N$19  (via drill 1.02)
  other vias: 62.89,67.28
N$20  (via drill 1.02)
  other vias: 46.05,67.72
N$21  (via drill 1.02)
  other vias: 42.21,73
N$22  (via drill 1.02)
  other vias: 31.19,82.17
N$23  (via drill 1.02)
  other vias: 30.2,79.96
N$24  (via drill 1.02)
  other vias: 59.11,87.43
N$25  (via drill 1.02)
  other vias: 57.07,82.42
N$26  (via drill 3.45 pad 5.08)
  other vias: 5.08,121.92
N$27  (via drill 3.45 pad 5.08)
  other vias: 96.52,121.92
N$28  (via drill 3.45 pad 5.08)
  other vias: 96.52,5.08
N$29  (via drill 3.45 pad 5.08)
  other vias: 5.08,5.08
N$30  (1 unrouted)
  Top 0.61: R2S.TP 23.88,86.28 23.88,112.78 25.4,114.3 25.4,119.38 SV1.1
N$31  (1 unrouted)
  Top 0.61: SV1.3 30.48,119.38 30.48,82.88 FUSES.TP
N$32  (1 unrouted)
  Top 0.61: SV1.5 33.02,119.38 33.02,108.2 31.75,106.93 31.75,91.59 BTCSB.TP
N$33  (1 unrouted)
  Top 0.61: SV1.7 35.56,119.38 35.56,114.81 34.29,113.54 34.29,108.2 32.77,106.68 32.77,92.63 38.28,87.12 BTMOSI.TP
N$34  (1 unrouted)
  Top 0.61: SV1.9 38.1,119.38 38.1,111.76 35.31,108.97 35.31,107.7 33.78,106.17 33.78,93.5 39.65,87.63 BTMISO.TP
N$35  (1 unrouted)
  Top 0.61: SV1.11 40.64,119.38 40.64,107.95 36.32,103.63 36.32,101.09 35.31,100.08 35.31,95 41.17,89.13 SPICLK.TP
N$36  (1 unrouted)
  Top 0.61: SV1.13 43.18,119.38 43.18,108.46 37.59,102.87 37.59,101.09 37.06,100.56 BT_RX.TP
N$37  (1 unrouted)
  Top 0.61: SV1.15 45.72,119.38 45.72,109.22 38.81,102.31 BT_TX.TP
N$38  (1 unrouted)
  Top 0.61: SV1.17 48.26,119.38 48.26,106.48 BT_CMD.TP
N$39  (1 unrouted)
  Top 0.61: SV1.19 49.53,120.4 50.8,119.13 50.8,106.35 BT_RST.TP
N$40
  Top 0.61: SV1.23 55.88,119.38 55.88,116.84 54.61,115.57 54.61,104.14 46.06,95.59 MCLR.TP
N$41
  Top 0.61: SV1.21 53.34,119.38 53.34,104.65 44.45,95.76 44.45,80.77 42.2,78.52 AVR_RESET.TP
N$42
  Top 0.61: SV1.25 58.42,119.38 58.42,114.55 55.88,112.01 55.88,102.87 51.05,98.04 51.05,79.5 58,72.56 PGC.TP
N$43
  Top 0.61: SV1.27 60.96,119.38 60.96,99.82 56.13,95 56.13,85.6 53.59,83.06 53.59,81.03 59.85,74.77 PGD.TP
N$44  (1 unrouted)
  Top 0.61: SV1.29 63.5,119.38 63.5,112.01 61.98,110.49 61.98,97.28 57.06,92.37 R1S.TP
N$45  (1 unrouted)
  Top 0.61: SV1.31 66.04,119.38 66.04,116.59 64.52,115.06 64.52,105.41 63.25,104.14 63.25,97.28 59.08,93.12 USBID.TP
N$46
  Top 0.61: SV1.33 68.58,119.38 68.58,115.82 65.53,112.78 65.53,93.98 60.71,89.15 60.71,87.12 59.18,85.6 59.18,77.22 61.21,75.18 61.21,68.58 61.34,68.45 62.49,67.3 SDI.TP
N$47
  Top 0.61: SV1.35 71.12,119.38 71.12,116.08 67.82,112.78 67.82,101.6 69.34,100.08 69.34,92.46 61.21,84.33 61.21,76.71 62.99,74.93 62.99,69.24 SDO.TP
N$48
  Top 0.61: SV1.37 73.66,119.38 73.66,117.09 71.37,114.81 71.37,92.2 63.05,83.88 SCK.TP
N$49
  Top 0.61: SV1.39 76.45,119.13 76.45,114.81 73.66,112.01 73.66,91.69 66.29,84.33 66.29,82.3 67.84,80.75 3.3V.TP
N$50
  Bottom 0.61: SV1.40 71.96,115.14 BATS.TP
N$51
  Bottom 0.61: SV1.38 69.09,114.81 69.09,111.76 70.1,110.74 70.1,83.11 5V.TP
N$52
  Bottom 0.61: SV1.36 69.85,117.35 67.56,115.06 67.56,95.64 D-.TP
N$53
  Bottom 0.61: SV1.34 67.31,116.59 65.28,114.55 65.28,96.46 D+.TP
N$54  (1 unrouted)
  Bottom 0.61: SV1.32 64.77,116.84 60.2,112.27 60.2,93.73 68.49,85.43 GND.PP
RAIL1  (11 unrouted)
RAIL2  (11 unrouted)

### Text on the board
tPlace: DyIO REV E Testing Jig
bNames: D+ | D- | GND | V3.3 | AVR_RST | PIC_PGC | PIC_PGD | MISO | PIC32_MCLR | MOSI
tValues: WASP Connector | Power 6.6 to 12v
200bmp: /home/acamilo/Downloads/logo_blurb.bmp